# EAGLE design OSO-MISC-21-011 RFID (EAGLE 9.6.2)
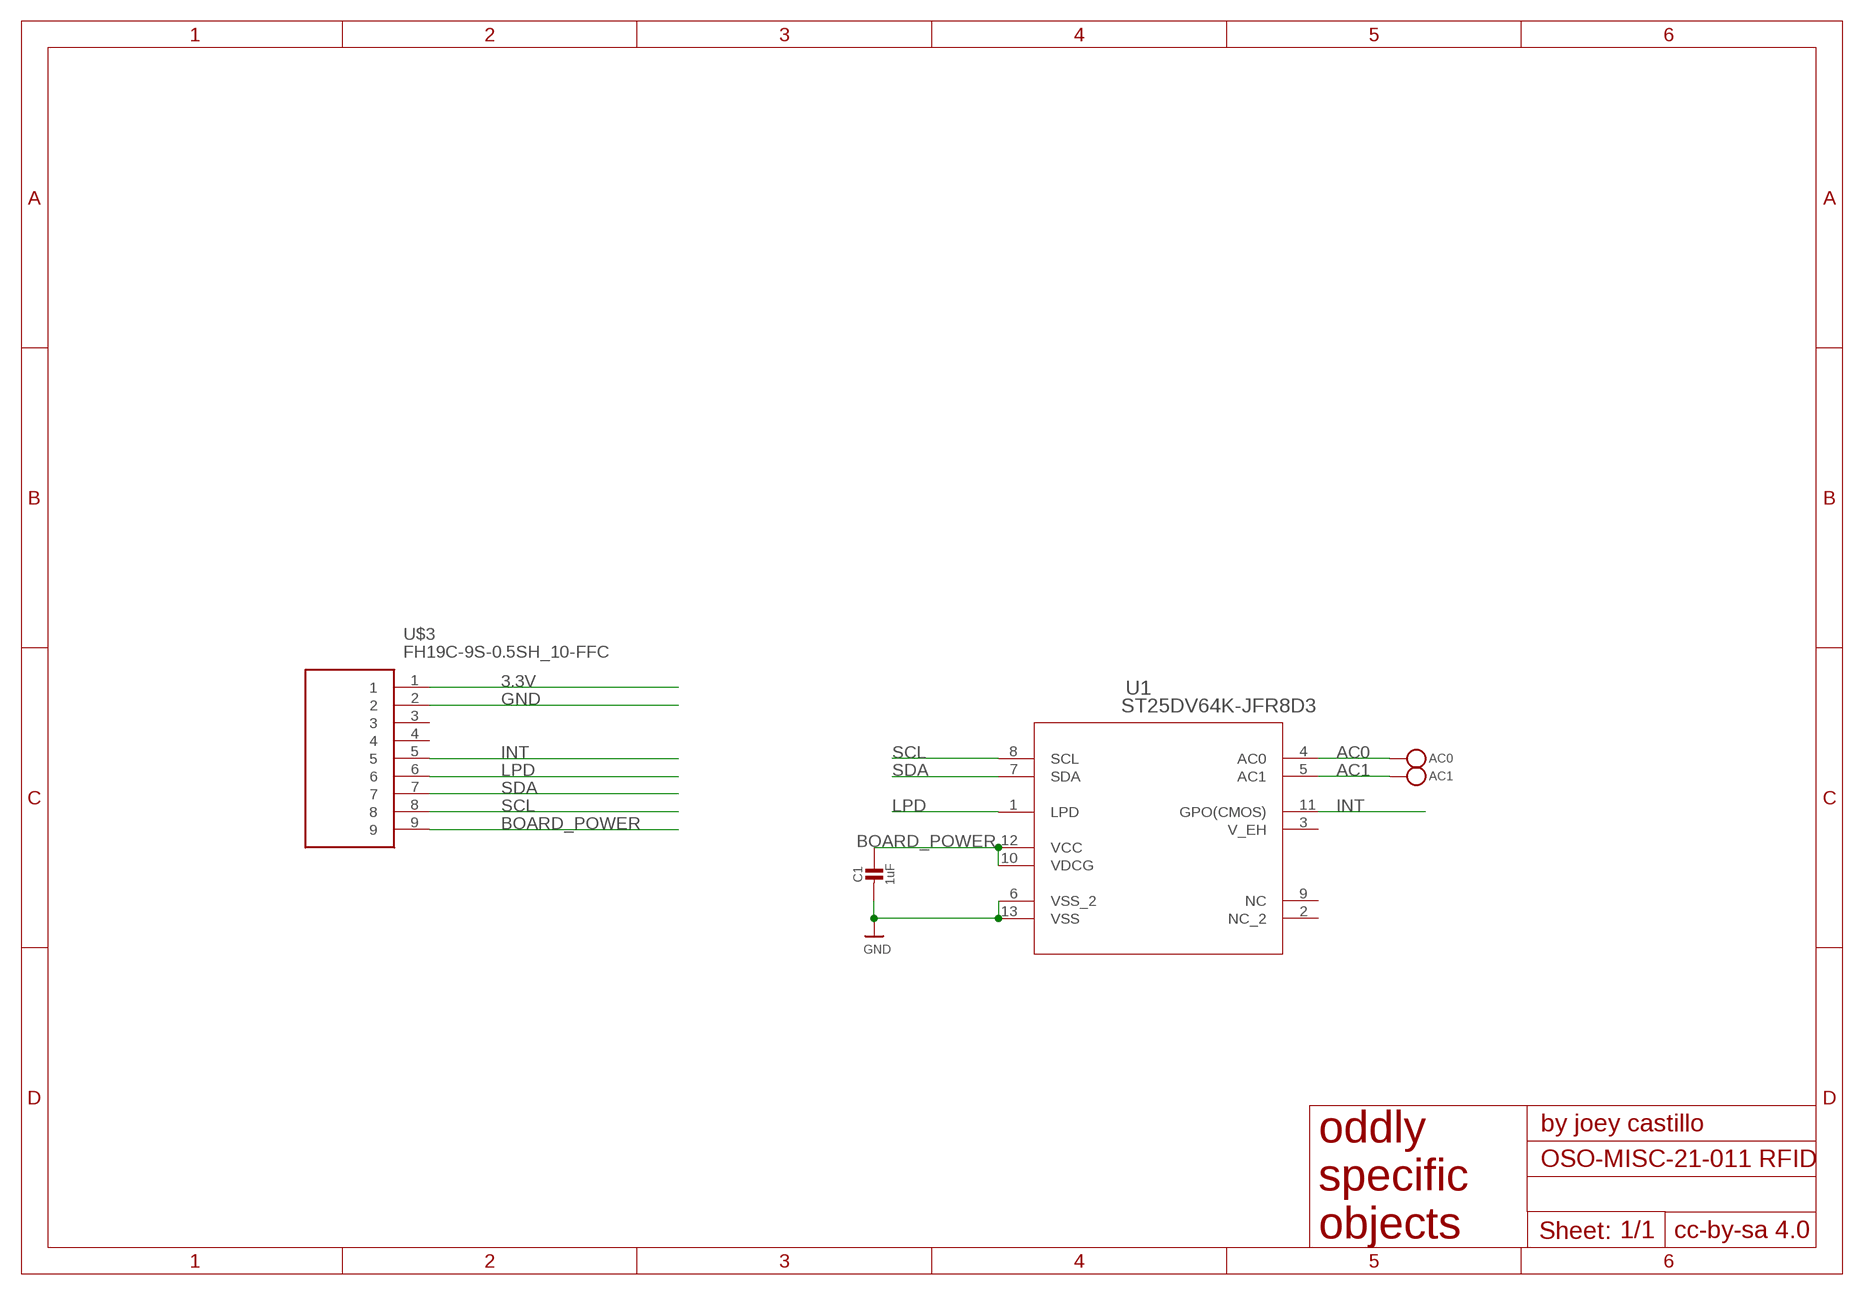
[diagram p0: schematic, sheet 1]

## Parts
AC0  MICROBUILDER_TESTPOINT1.5X2.0MM_NOCREAM  [MICROBUILDER_PAD-1.5X2.0]
AC1  MICROBUILDER_TESTPOINT1.5X2.0MM_NOCREAM  [MICROBUILDER_PAD-1.5X2.0]
C1  1uF  CAP_CERAMIC_0603MP  [_0603MP]
U1  ST25DV64K-JFR8D3  [UFDFPN12_3X3_STM]
U$3  FH19C-9S-0.5SH_10-FFC  [FH19C9S05SH10-FFC]

## Nets
3.3V [power]: U$3.1
AC0: AC0.P$1 U1.4(AC0)
AC1: AC1.P$1 U1.5(AC1)
BOARD_POWER: C1.1 U1.10(VDCG) U1.12(VCC) U$3.9
GND [gnd]: C1.2 U1.6(VSS_2) U1.13(VSS) U$3.2
INT: U1.11(GPO(CMOS)) U$3.5
LPD: U1.1(LPD) U$3.6
SCL: U1.8(SCL) U$3.8
SDA: U1.7(SDA) U$3.7
Unconnected: U1.2(NC_2) U1.3(V_EH) U1.9(NC) U$3.3 U$3.4

## Library data of the parts
AC0 AC1 = Adafruit Feather M0 Express:MICROBUILDER_TESTPOINT: Test Point Various test points for characterisation and PCB testing TESTPOINT_SMT - Compact Surface Mount Test Point [Digikey: 5016KTR-ND]
C1 = microbuilder:CAP_CERAMIC: Ceramic Capacitors For new designs, use the packages preceded by an '_' character since they are more reliable: The following footprints should be used on most boards: _0402 - Standard footprint for regular board layouts _0603 - Standard footprint for regular board layouts _0805 - Standard footprint for regular board layouts _1206 - Standard footprint for regular board layouts For extremely tight-pitch boards where space is at a premium, the following 'micro-pitch' footprints can be used (smaller pads, no silkscreen outline, etc.): _0402MP - Micro-pitch footprint for very dense/compact boards _0603MP - Micro-pitch footprint for very dense/compact boards _0805MP - Micro-pitch footprint for very dense/compact boards _1206MP - Micro-pitch footprint for very dense/compact boards
U1 = ST25DV64K:ST25DV64K-JFR8D3; COPYRIGHT: Copyright (C) 2021 Ultra Librarian. All rights reserved.; DIGI-KEY_PART_NUMBER_1: 497-19303-2-ND; DIGI-KEY_PART_NUMBER_2: 497-19303-1-ND; DIGI-KEY_PART_NUMBER_3: 497-19303-6-ND; MANUFACTURER_PART_NUMBER: ST25DV64K-JFR8D3; MFR_NAME: STMicroelectronics
U$3 = FH19C-9S-0.5SH:FH19C-9S-0.5SH_10-FFC

## Net classes
0 default: width 0.203 mm
1 power: width 0.203 mm
2 gnd: width 0.203 mm

## Board
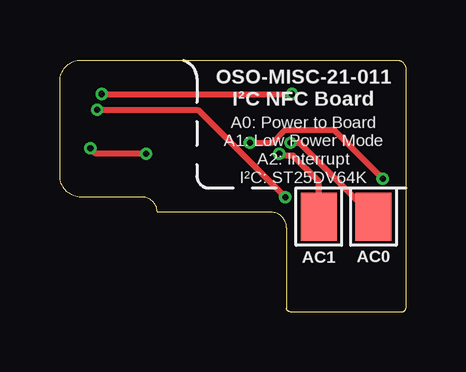
[diagram p1: board, top side]
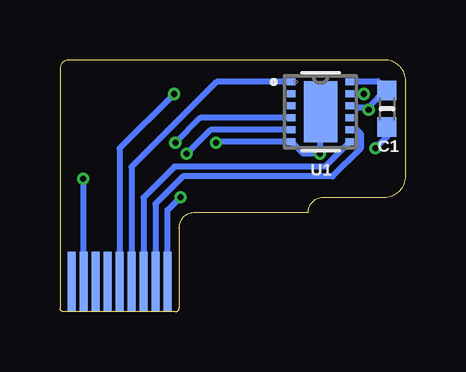
[diagram p2: board, bottom side, seen from below]

Size 14.43 x 10.48 mm. Coordinates in mm from the lower left corner, seen from the top.
Outline: 9.45,3.5 arc90 8.81,4.14 4.06,4.14 arc90 3.43,4.77 0.89,4.77 arc-90 0,5.66 0,9.6 arc-90 0.89,10.48 14.05,10.48 arc-90 14.43,10.1 14.43,3.5
Copper layers (1*16): Top 0.035559375mm / dielectric 4mil / Bottom 0.035559375mm
Design rules "oshpark-2layer *": minimum track width 6mil, minimum drill 10mil, track to track 6mil, track to pad 6mil, pad to pad 6mil, via to via 6mil, smd to smd 6mil, copper to edge 15mil, drill to drill 6mil, minimum pad ring 5mil, minimum via ring 5mil, stop-mask expansion 2.5mil, vias tented up to drill 12mil, thermal gap 10mil

### Footprints (pad centres in the part's own frame; a part is rotated, then mirrored left to right if it is on the bottom)
MICROBUILDER_PAD-1.5X2.0 = smd 1.5 x 2: P$1 0,0
_0603MP = smd 0.8 x 0.8: 1 -0.762,0; 2 0.762,0
UFDFPN12_3X3_STM = smd 0.356 x 0.305: 1 -1.219,1.25; 2 -1.219,0.75; 3 -1.219,0.25; 4 -1.219,-0.25; 5 -1.219,-0.75; 6 -1.219,-1.25; 7 1.219,-1.25; 8 1.219,-0.75; 9 1.219,-0.25; 10 1.219,0.25; 11 1.219,0.75; 12 1.219,1.25 | smd 1.397 x 2.54: 13 0,0
FH19C9S05SH10-FFC = smd 0.347 x 2.5 bottom: 1 2,-2.25; 2 1.5,-2.25; 3 1,-2.25; 4 0.5,-2.25; 5 0,-2.25; 6 -0.5,-2.25; 7 -1,-2.25; 8 -1.5,-2.25; 9 -2,-2.25

### Placement (x,y rotation side)
AC0  13.08,3.96 0 top
AC1  10.79,3.96 0 top
C1  0.79,8.45 270 bottom
U1  3.56,8.33 0 bottom
U$3  11.94,3.5 0 top

### Tracks (layer width: path | path; a pad name or v marks a point on that pad's centre or on a via)
AC0  (via drill 0.25)
  Top 0.254: AC0.P$1 10,7.04 v9.61,7.04
  Bottom 0.254: v9.61,7.04 8.58,8.08 U1.4
AC1  (via drill 0.25)
  Top 0.254: AC1.P$1 10.79,5.43 9.73,6.5 9.22,6.5 v9.14,6.57
  Bottom 0.254: v9.14,6.57 8.14,7.58 U1.5
BOARD_POWER  (via drill 0.25)
  Top 0.254: v1.55,8.41 5.76,8.41 v9.4,4.77
  Bottom 0.254: U1.12 2.31,9.6 1.17,9.6 C1.1 0.85,9.21 1.55,8.51 | U1.10 2.11,8.58 2.04,8.51 1.55,8.51 | 1.55,8.51 v1.55,8.41 | U$3.9 9.94,4.23 v9.4,4.77
GND  (via drill 0.25)
  Top 0.254: v3.59,6.58 1.49,6.58 v1.27,6.8 | v7.92,7.04 8.86,7.04 9.39,7.57 11.42,7.57 v13.46,5.53
  Bottom 0.254: v1.27,6.8 0.79,7.29 C1.2 | v7.92,7.04 7.89,7.08 U1.6 4.28,6.58 v3.59,6.58 3.59,8.29 U1.13 | v13.46,5.53 13.46,1.27 U$3.2
INT  (via drill 0.25)
  Top 0.254: v1.75,9.07 v9.67,9.07
  Bottom 0.254: U1.11 v1.75,9.07 | U$3.5 11.94,6.8 v9.67,9.07
LPD
  Bottom 0.254: U1.1 7.89,9.58 11.44,6.03 U$3.6
SCL
  Bottom 0.254: U1.8 2.04,7.58 1.88,7.41 1.88,6.81 3.05,5.63 9.3,5.63 10.44,4.49 U$3.8
SDA
  Bottom 0.254: U1.7 3.37,6.04 9.65,6.04 10.94,4.75 U$3.7

### Text on the board
tPlace: OSO-MISC-21-011 / I²C NFC Board | A0: Power to Board / A1: Low Power Mode / A2: Interrupt / I²C: ST25DV64K